# EAGLE design G-PiC MotorShield (EAGLE 6.3)
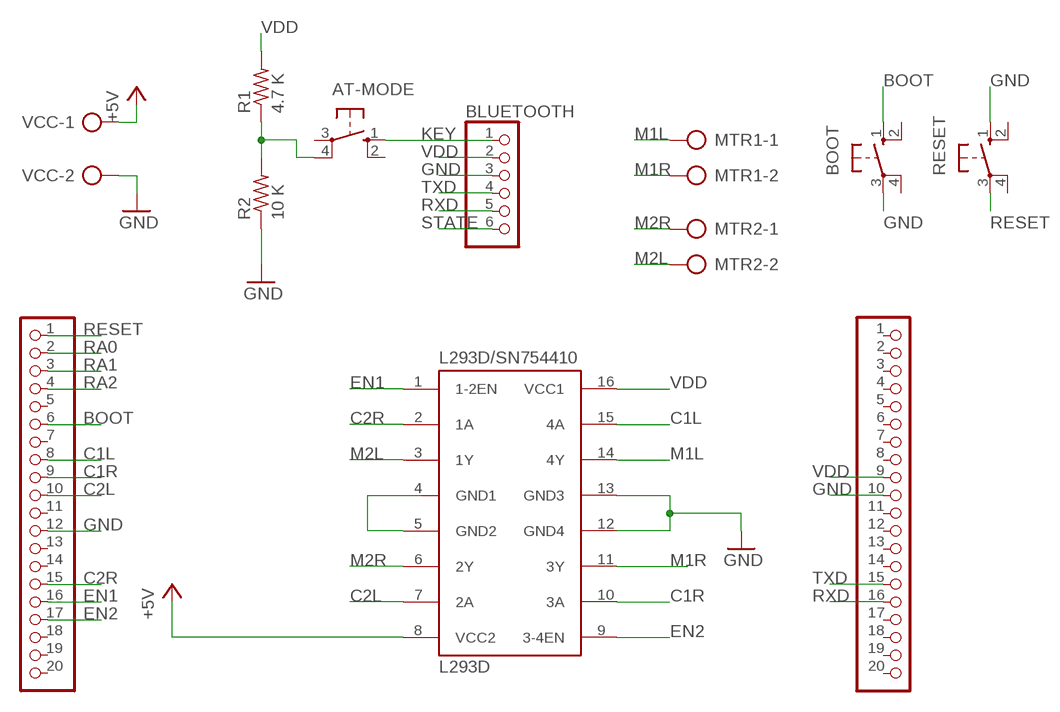
[diagram p0: schematic, sheet 1]

## Parts
AT-MODE  10-XX  [B3F-10XX]
BLUETOOTH  PINHD-1X6  [1X06]
BOOT  10-XX  [B3F-10XX]
JP1  PINHD-1X20  [1X20]
JP2  PINHD-1X20  [1X20]
L293D/SN754410  L293D  [DIL16]
MTR1  AK300/2  [AK300/2]
MTR2  AK300/2  [AK300/2]
R1  4.7 K  R-US_0204/7  [0204/7]
R2  10 K  R-US_0204/7  [0204/7]
RESET  10-XX  [B3F-10XX]
VCC  AK300/2  [AK300/2]

## Nets
+5V [2 Amperes]: L293D/SN754410.8(VCC2) VCC.1
BOOT [Digital]: BOOT.1(S) JP2.6
C1L [Digital]: JP2.8 L293D/SN754410.15(4A)
C1R [Digital]: JP2.9 L293D/SN754410.10(3A)
C2L [Digital]: JP2.10 L293D/SN754410.7(2A)
C2R [Digital]: JP2.15 L293D/SN754410.2(1A)
EN1 [Digital]: JP2.16 L293D/SN754410.1(1-2EN)
EN2 [Digital]: JP2.17 L293D/SN754410.9(3-4EN)
GND [Digital]: BLUETOOTH.3 BOOT.3(P) JP1.10 JP2.12 L293D/SN754410.12(GND4) L293D/SN754410.13(GND3) R2.1 RESET.1(S) VCC.2
KEY [Digital]: AT-MODE.4(P1) R1.1 R2.2
M1L [1 Ampere]: L293D/SN754410.14(4Y) MTR1.1
M1R [1 Ampere]: L293D/SN754410.11(3Y) MTR1.2
M2L [1 Ampere]: L293D/SN754410.3(1Y) MTR2.2
M2R [1 Ampere]: L293D/SN754410.6(2Y) MTR2.1
N$1: L293D/SN754410.4(GND1) L293D/SN754410.5(GND2)
N$3: AT-MODE.1(S) BLUETOOTH.1
RA0: JP2.2
RA1 [Digital]: JP2.3
RA2 [Digital]: JP2.4
RESET [Digital]: JP2.1 RESET.3(P)
RXD [Digital]: BLUETOOTH.5 JP1.16
STATE: BLUETOOTH.6
TXD [Digital]: BLUETOOTH.4 JP1.15
VDD [Digital]: BLUETOOTH.2 JP1.9 L293D/SN754410.16(VCC1) R1.2
Unconnected: AT-MODE.2(S1) AT-MODE.3(P) BOOT.2(S1) BOOT.4(P1) JP1.1 JP1.2 JP1.3 JP1.4 JP1.5 JP1.6 JP1.7 JP1.8 JP1.11 JP1.12 JP1.13 JP1.14 JP1.17 JP1.18 JP1.19 JP1.20 JP2.5 JP2.7 JP2.11 JP2.13 JP2.14 JP2.18 JP2.19 JP2.20 RESET.2(S1) RESET.4(P1)

## Library data of the parts
AT-MODE BOOT RESET = switch-omron:10-XX: OMRON SWITCH; MPN: B3F-1000; OC_FARNELL: 176432; OC_NEWARK: 36M3542
BLUETOOTH = pinhead:PINHD-1X6: PIN HEADER
JP1 JP2 = pinhead:PINHD-1X20: PIN HEADER
L293D/SN754410 = st-microelectronics:L293D: PUSH-PULL 4 CHANNEL DRIVER; MPN: L293D; OC_FARNELL: 9589619; OC_NEWARK: 56P8249
MTR1 MTR2 VCC = con-ptr500:AK300/2: CONNECTOR; OC_FARNELL: unknown; OC_NEWARK: unknown
R1 R2 = resistor:R-US_: RESISTOR, American symbol

## Net classes
1 Digital: width 0.5 mm
2 2 Amperes: width 0.9 mm
3 1 Ampere: width 0.7 mm

## Board
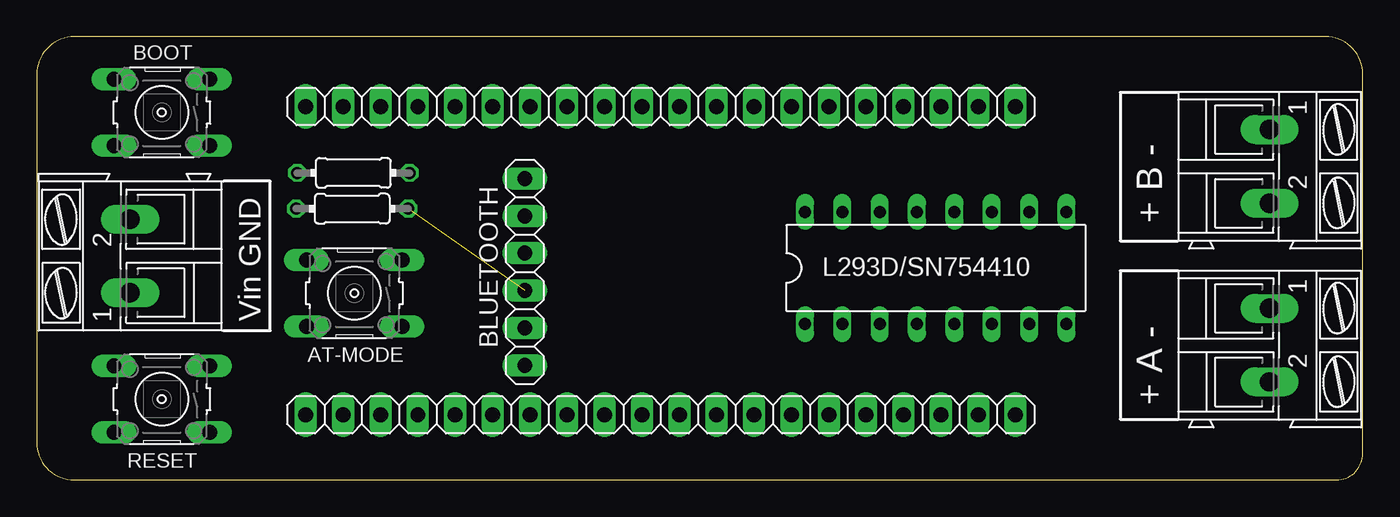
[diagram p1: board, top side]
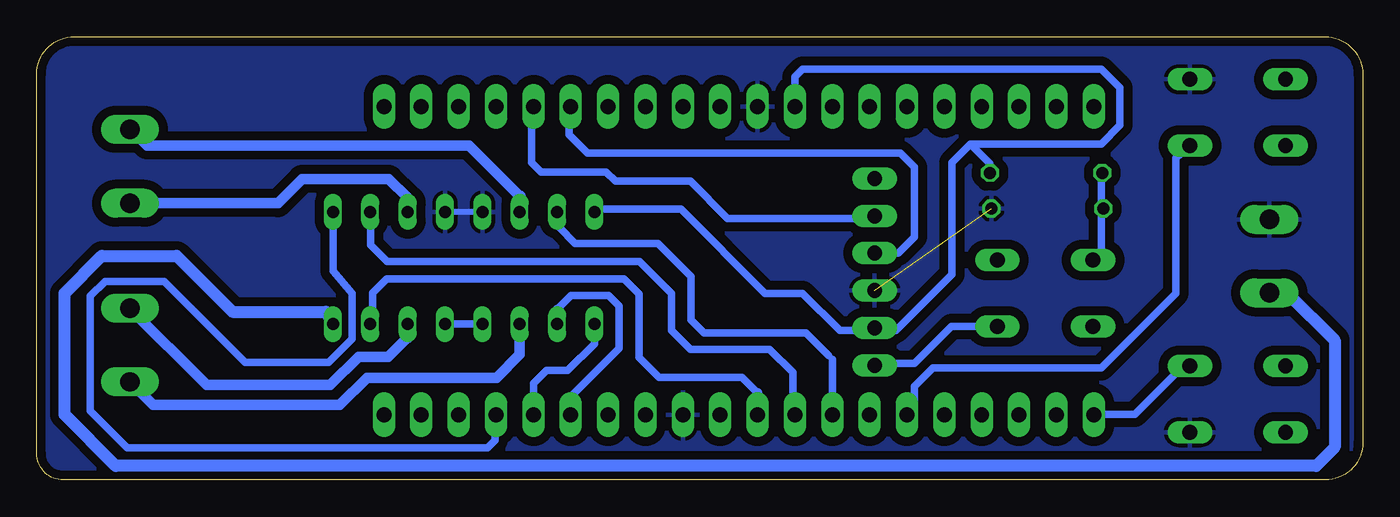
[diagram p2: board, bottom side, seen from below]

Size 90.15 x 30.15 mm. Coordinates in mm from the lower left corner, seen from the top.
Outline: 0,27.59 0,2.54 arc90 2.54,0 88.37,0 arc90 90.15,1.78 90.15,27.61 arc90 87.61,30.15 2.56,30.15 arc90 0,27.59
Copper layers (1*16): Top 0.0356mm / dielectric 1.5011mm / Bottom 0.0356mm
Design rules: minimum track width 6mil, minimum drill 13mil, track to track 6mil, track to pad 6mil, pad to pad 6mil, via to via 6mil, smd to smd 6mil, copper to edge 15mil, drill to drill 6mil, minimum pad ring 7mil, minimum via ring 7mil, stop-mask expansion 4mil, vias tented up to drill 0mil, thermal gap 10mil

### Footprints (pad centres in the part's own frame; a part is rotated, then mirrored left to right if it is on the bottom)
B3F-10XX = drill 1.016 long: 1 -3.251,2.261; 2 3.251,2.261; 3 -3.251,-2.261; 4 3.251,-2.261
1X06 = drill 1.016 long: 1 -6.35,0; 2 -3.81,0; 3 -1.27,0; 4 1.27,0; 5 3.81,0; 6 6.35,0
1X20 = drill 1.016 long: 1 -24.13,0; 2 -21.59,0; 3 -19.05,0; 4 -16.51,0; 5 -13.97,0; 6 -11.43,0; 7 -8.89,0; 8 -6.35,0; 9 -3.81,0; 10 -1.27,0; 11 1.27,0; 12 3.81,0; 13 6.35,0; 14 8.89,0; 15 11.43,0; 16 13.97,0; 17 16.51,0; 18 19.05,0; 19 21.59,0; 20 24.13,0
DIL16 = drill 0.813 long: 1 -8.89,-3.81; 2 -6.35,-3.81; 3 -3.81,-3.81; 4 -1.27,-3.81; 5 1.27,-3.81; 6 3.81,-3.81; 7 6.35,-3.81; 8 8.89,-3.81; 9 8.89,3.81; 10 6.35,3.81; 11 3.81,3.81; 12 1.27,3.81; 13 -1.27,3.81; 14 -3.81,3.81; 15 -6.35,3.81; 16 -8.89,3.81
AK300/2 = drill 1.321 long: 1 -2.515,0; 2 2.489,0
0204/7 = drill 0.813 octagon: 1 -3.81,0; 2 3.81,0

### Placement (x,y rotation side)
AT-MODE  21.59,12.7 180 top
BLUETOOTH  33.18,14.16 90 top
BOOT  8.5,25 180 top
JP1  42.42,25.4 0 top
JP2  42.42,4.44 0 top
L293D/SN754410  61.12,14.42 0 top
MTR1  83.82,21.32 270 top
MTR2  83.82,9.16 270 top
R1  21.53,20.89 0 top
R2  21.45,18.45 180 top
RESET  8.5,5.5 180 top
VCC  6.35,15.24 90 top

### Tracks (layer width: path | path; a pad name or v marks a point on that pad's centre or on a via)
+5V
  Bottom 0.8: L293D/SN754410.8 70.48,11.43 76.83,11.43 80.64,15.24 85.72,15.24 88.27,12.7 88.27,4.45 84.77,0.95 3.17,0.95 1.91,2.22 1.91,9.53 5.08,12.7 6.35,12.7
  Bottom 0.9: 6.35,12.7 VCC.1
BOOT
  Bottom 0.5: BOOT.1 12.7,21.91 12.7,12.7 17.78,7.62 29.21,7.62 30.48,6.35 30.48,5.08 JP2.6
C1L
  Bottom 0.406: 36,4.37 JP2.8
  Bottom 0.45: 36.07,8.19 36.34,8.46
  Bottom 0.5: 36.34,8.46 37.87,9.99 44.78,9.99 45.68,10.89 45.68,13.86 47.92,16.09 53.55,16.09 54.64,17.19 54.64,18.09 L293D/SN754410.15 | JP2.8 36.07,8.19
C1R
  Bottom 0.5: L293D/SN754410.10 | L293D/SN754410.10 67.46,15.99 66.34,14.87 49.16,14.87 46.99,12.7 46.99,10.16 45.72,8.89 40.32,8.89 38.73,7.3 38.73,4.57 JP2.9
  Bottom 0.61: L293D/SN754410.10
C2L
  Bottom 0.5: 41.15,5.93 42.19,6.97 47.84,6.97 49.19,8.32 49.19,12.64 50.23,13.68 66.36,13.68 67.32,12.72 67.32,10.76 L293D/SN754410.7 67.43,10.66
  Bottom 0.6: JP2.10 41.15,5.93
C2R
  Bottom 0.5: 54.77,11.61 53.82,12.56 51.27,12.56 50.55,11.84 50.55,8.96 53.9,5.6
  Bottom 0.61: L293D/SN754410.2 54.77,11.61 | 53.9,5.6 53.9,4.5 JP2.15
EN1
  Bottom 0.5: L293D/SN754410.1 52.23,9.27 54.06,7.44 55.5,7.44 56.38,6.56 56.38,4.45
  Bottom 0.61: 56.38,4.45 JP2.16
EN2
  Bottom 0.5: JP2.17 59,4.37 59,2.7 59.5,2.2 84,2.2 86.5,4.7 86.5,12.5 85.5,13.5 81.5,13.5 75.99,7.99 70.31,7.99 68.72,9.58 68.72,12.7 70.01,14.21 L293D/SN754410.9
GND  (1 unrouted)
  Bottom 0.406: L293D/SN754410.13 L293D/SN754410.12
  pour Bottom (isolate 0.61): 0,0 0,30.4 90.17,30.4 90.17,0
KEY
  Bottom 0.5: 17.78,19.05 17.78,20.32 R1.1 | 17.78,19.05 17.78,15.56 AT-MODE.4 | 17.78,19.05 R2.2
M1L
  Bottom 0.7: 57.31,19.3 60.76,22.75 82.65,22.75 83.39,23.49
  Bottom 0.813: 82.98,23.16 83.39,23.49 MTR1.1 | L293D/SN754410.14 57.31,19.3
M1R
  Bottom 0.7: L293D/SN754410.11 64.93,19.2 66.21,20.47 72.11,20.47 73.75,18.83 MTR1.2
  Bottom 0.813: MTR1.2
M2L
  Bottom 0.5: 82.22,5.09 82.24,5.09
  Bottom 0.7: L293D/SN754410.3 57.31,8.53 58.89,6.95 67.68,6.95 69.54,5.09 82.22,5.09 | 82.24,5.09 MTR2.2
M2R
  Bottom 0.406: MTR2.1 83.82,11.82
  Bottom 0.7: 64.93,9.71 66.27,8.38 68.28,8.38 70.2,6.46 78.61,6.46 MTR2.1
  Bottom 0.813: L293D/SN754410.6 64.93,9.71
N$1
  Bottom 0.5: L293D/SN754410.4 L293D/SN754410.5
N$3
  Bottom 0.5: AT-MODE.1 27.98,10.44 30.48,7.94 33.05,7.94 BLUETOOTH.1
RESET
  Bottom 0.5: RESET.3 12.19,7.76 15.5,4.45 JP2.1
RXD
  Bottom 0.5: JP1.16 56.52,25.27 56.52,21.59 55.88,20.95 51.44,20.95 50.8,20.32 45.72,20.32 43.18,17.78 33.37,17.78 BLUETOOTH.5
TXD
  Bottom 0.5: BLUETOOTH.4 31.56,15.43 30.48,16.51 30.48,21.27 31.43,22.23 52.7,22.23 53.98,23.5 53.98,25.27 JP1.15
VDD
  Bottom 0.406: 38.5,25.51 JP1.9
  Bottom 0.5: L293D/SN754410.16 52.05,18.41 46.35,18.41 40.64,12.7 38.1,12.7 35.56,10.16 33.37,10.16 BLUETOOTH.2 32.99,10.16 31.75,10.16 27.94,13.97 27.94,21.59 26.67,22.86 | JP1.9 38.61,27.43 38.1,27.94 17.78,27.94 16.51,26.67 16.51,24.13 17.78,22.86 26.67,22.86 | R1.2 25.34,21.53 26.67,22.86

### Text on the board
tNames: + B - | Vin GND | + A -
tValues: Motor Shield | State | RXD | TXD | GND | VDD | Key | Rev. 1
Logo_G-PiC: C:/Users/Mike Menendez/Downloads/Logo G-PiC.bmp | C:/Users/Mike Menendez/Downloads/Logo G-PiC.bmp